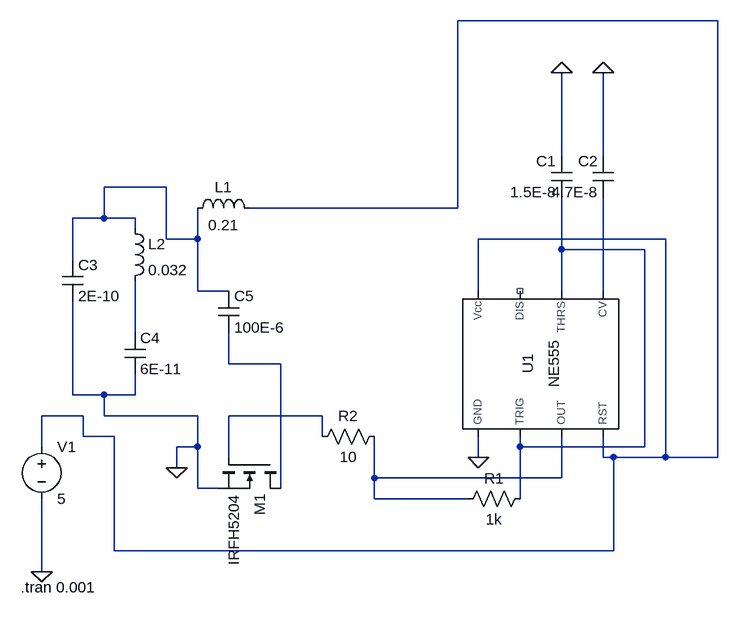
[diagram p0: schematic Humidifier.asc]
Humidifier.asc, the LTspice schematic file:
Version 4
SHEET 1 880 680
WIRE 656 -240 256 -240
WIRE 416 -32 416 -160
WIRE 480 -32 480 -160
WIRE -192 16 -288 16
WIRE 256 48 256 -240
WIRE 256 48 -64 48
WIRE -288 64 -288 16
WIRE -288 64 -336 64
WIRE -240 64 -288 64
WIRE -240 80 -240 64
WIRE -192 96 -192 16
WIRE -144 96 -144 48
WIRE -144 96 -192 96
WIRE 576 96 288 96
WIRE 416 112 416 32
WIRE 544 112 416 112
WIRE -336 128 -336 64
WIRE -144 176 -144 96
WIRE -96 176 -144 176
WIRE 288 176 288 96
WIRE 416 176 416 112
WIRE 480 176 480 32
WIRE -240 240 -240 160
WIRE -96 288 -96 240
WIRE -16 288 -96 288
WIRE -336 336 -336 192
WIRE -288 336 -336 336
WIRE -240 336 -240 304
WIRE -240 336 -288 336
WIRE -320 368 -384 368
WIRE -288 368 -288 336
WIRE -144 368 -288 368
WIRE 48 368 -96 368
WIRE -320 400 -320 368
WIRE -272 400 -320 400
WIRE 48 400 48 368
WIRE -384 416 -384 368
WIRE -144 416 -144 368
WIRE -144 416 -176 416
WIRE 352 416 352 400
WIRE 544 416 544 112
WIRE 544 416 352 416
WIRE -96 432 -96 368
WIRE 288 432 288 400
WIRE 480 432 480 400
WIRE 496 432 480 432
WIRE 576 432 576 96
WIRE 576 432 496 432
WIRE 656 432 656 -240
WIRE 656 432 576 432
WIRE -176 448 -176 416
WIRE 128 464 128 400
WIRE 416 464 416 400
WIRE 416 464 128 464
WIRE -144 480 -144 416
WIRE -112 480 -144 480
WIRE -16 480 -16 288
WIRE 128 496 128 464
WIRE 272 496 128 496
WIRE 352 496 352 416
WIRE -272 576 -272 400
WIRE 496 576 496 432
WIRE 496 576 -272 576
WIRE -384 608 -384 496
FLAG 416 -160 0
FLAG 480 -160 0
FLAG -384 608 0
FLAG 288 432 0
FLAG -176 448 0
SYMBOL ind -160 64 R270
WINDOW 0 32 56 VTop 2
WINDOW 3 5 56 VBottom 2
SYMATTR InstName L1
SYMATTR Value 0.21
SYMBOL Misc\\NE555 384 288 R270
SYMATTR InstName U1
SYMBOL cap 432 32 R180
WINDOW 0 24 56 Left 2
WINDOW 3 24 8 Left 2
SYMATTR InstName C1
SYMATTR Value 1.5E-8
SYMBOL cap 496 32 R180
WINDOW 0 24 56 Left 2
WINDOW 3 24 8 Left 2
SYMATTR InstName C2
SYMATTR Value 4.7E-8
SYMBOL res 368 480 R90
WINDOW 0 0 56 VBottom 2
WINDOW 3 32 56 VTop 2
SYMATTR InstName R1
SYMATTR Value 1k
SYMBOL res 144 384 R90
WINDOW 0 0 56 VBottom 2
WINDOW 3 32 56 VTop 2
SYMATTR InstName R2
SYMATTR Value 10
SYMBOL voltage -384 400 R0
WINDOW 123 0 0 Left 0
WINDOW 39 0 0 Left 0
SYMATTR InstName V1
SYMATTR Value 5
SYMBOL cap -352 128 R0
SYMATTR InstName C3
SYMATTR Value 2E-10
SYMBOL cap -256 240 R0
SYMATTR InstName C4
SYMATTR Value 6E-11
SYMBOL ind -256 64 R0
SYMATTR InstName L2
SYMATTR Value 0.032
SYMBOL cap -112 176 R0
SYMATTR InstName C5
SYMATTR Value 100E-6
SYMBOL nmos -16 432 R90
SYMATTR InstName M1
SYMATTR Value IRFH5204
TEXT -416 632 Left 2 !.tran 0.001

The netlist it stands for:
* Humidifier.asc
L1 N002 N001 0.21
XU1 0 N003 N008 N001 N004 N003 NC_01 N001 NE555  ; pins GND TRIG OUT RST CV THRS DIS Vcc
C1 N003 0 1.5E-8
C2 N004 0 4.7E-8
R1 N003 N008 1k
R2 N008 N007 10
V1 N001 0 5
C3 N002 0 2E-10
C4 N005 0 6E-11
L2 N002 N005 0.032
C5 N002 N006 100E-6
M1 N006 N007 0 0 IRFH5204
.model NMOS NMOS
.model PMOS PMOS
.lib standard.mos
.tran 0.001
.lib NE555.sub
.backanno
.end